# EAGLE schematic grip_strength_schematic (EAGLE 8.1.0)
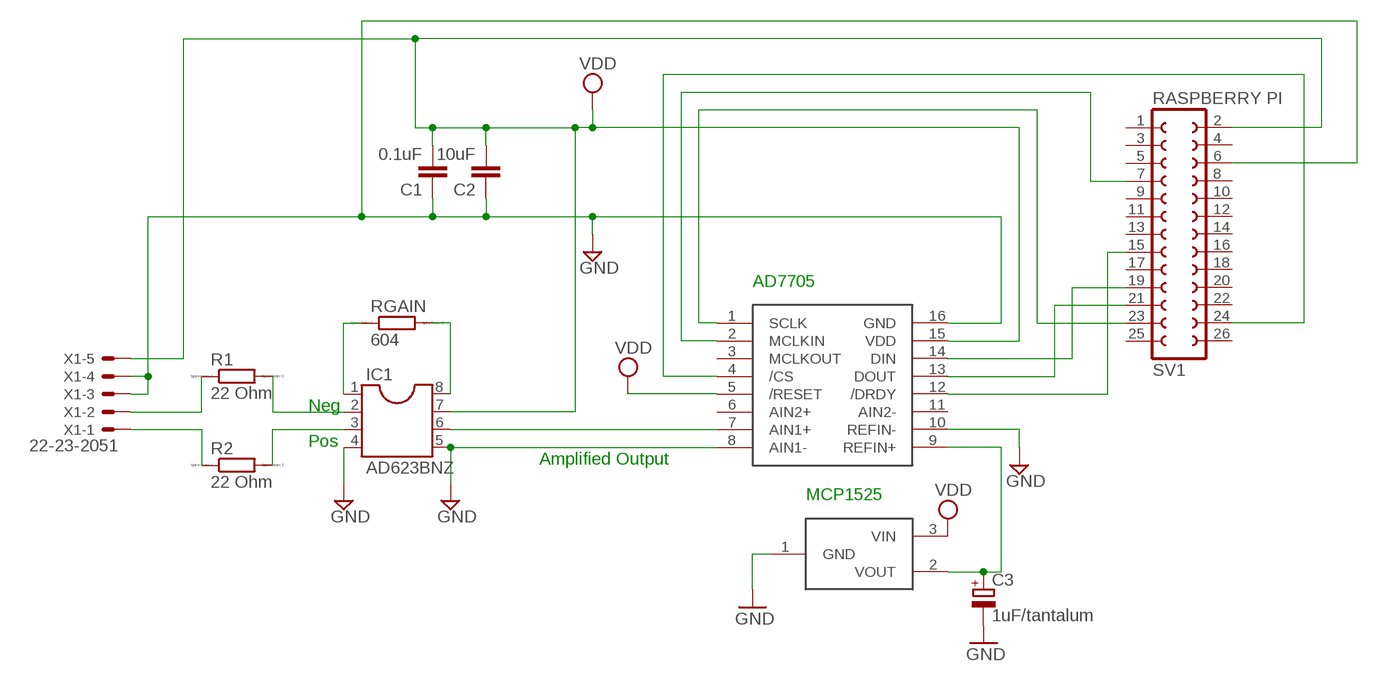
[diagram p0: schematic, sheet 1]

## Parts
C1  0.1uF  C5/2.5  [C5B2.5]
C2  10uF  C5/2.5  [C5B2.5]
C3  1uF/tantalum  CPOL-EUTT2D7  [TT2D7]
IC1  AD623BNZ  DIL8S  [SOCKET-08]
R1  22 Ohm  R0207/10  [0207/10]
R2  22 Ohm  R0207/10  [0207/10]
RGAIN  604  R0207/10  [0207/10]
SV1  RASPBERRY PI  FE13-2  [FE13-2]
U$1  AD7705  [DIP16]
U$2  MCP1525  [TO92]
X1  22-23-2051  [22-23-2051]

## Nets
GND: C1.1 C2.1 C3.- IC1.4 IC1.5 SV1.6 U$1.8(AIN1-) U$1.10(REFIN-) U$1.16(GND) U$2.1(GND) X1.3 X1.4
N$1: IC1.1 RGAIN.1
N$2: IC1.8 RGAIN.2
N$3: R1.1 X1.2
N$4: IC1.2 R1.2
N$5: IC1.6 U$1.7(AIN1+)
N$6: SV1.23 U$1.1(SCLK)
N$7: SV1.7 U$1.2(MCLKIN)
N$8: SV1.24 U$1.4(/CS)
N$9: SV1.19 U$1.14(DIN)
N$10: SV1.21 U$1.13(DOUT)
N$11: SV1.15 U$1.12(/DRDY)
N$12: C3.+ U$1.9(REFIN+) U$2.2(VOUT)
N$13: R2.1 X1.1
N$14: IC1.3 R2.2
VDD: C1.2 C2.2 IC1.7 SV1.2 U$1.5(/RESET) U$1.15(VDD) U$2.3(VIN) X1.5
Unconnected: SV1.1 SV1.3 SV1.4 SV1.5 SV1.8 SV1.9 SV1.10 SV1.11 SV1.12 SV1.13 SV1.14 SV1.16 SV1.17 SV1.18 SV1.20 SV1.22 SV1.25 SV1.26 U$1.3(MCLKOUT) U$1.6(AIN2+) U$1.11(AIN2-)

## Notes on the sheet
- AD7705
- Neg
- Pos
- Amplified Output
- MCP1525

## Library data of the parts
C1 C2 = capacitor-wima:C: CAPACITOR naming: grid - package width
C3 = rcl:CPOL-EU: POLARIZED CAPACITOR, European symbol
IC1 = ic-package:DIL8: Dual In Line / Socket
R1 R2 RGAIN = eagle-ltspice:R: RESISTOR, European symbol; SPICEMODEL: NONE; SPICEPREFIX: R
SV1 = con-lsta:FE13-2: FEMALE HEADER; OC_FARNELL: unknown; OC_NEWARK: unknown
U$1 = rpi:AD7705
U$2 = rpi:MCP1525
X1 = con-molex:22-23-2051: .100" (2.54mm) Center Header - 5 Pin; MF: MOLEX; MPN: 22-23-2051; OC_FARNELL: 1462952; OC_NEWARK: 38C9178